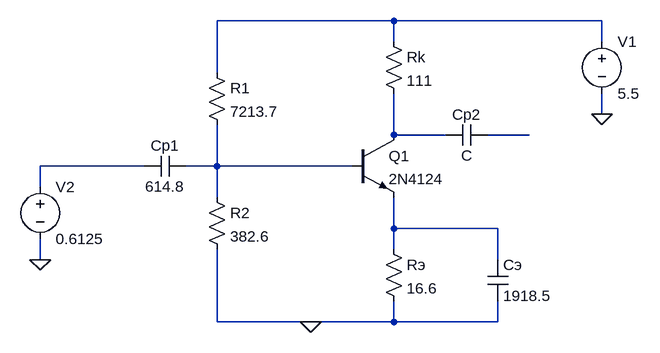
[diagram p0: schematic Draft1.asc]
Draft1.asc, the LTspice schematic file:
Version 4
SHEET 1 944 680
WIRE 560 -64 288 -64
WIRE 880 -64 560 -64
WIRE 560 -32 560 -64
WIRE 880 -32 880 -64
WIRE 288 16 288 -64
WIRE 880 80 880 48
WIRE 560 112 560 48
WIRE 640 112 560 112
WIRE 768 112 704 112
WIRE 176 160 16 160
WIRE 288 160 288 96
WIRE 288 160 240 160
WIRE 496 160 288 160
WIRE 16 192 16 160
WIRE 288 208 288 160
WIRE 560 256 560 208
WIRE 720 256 560 256
WIRE 560 288 560 256
WIRE 16 304 16 272
WIRE 720 304 720 256
WIRE 288 400 288 288
WIRE 432 400 288 400
WIRE 560 400 560 368
WIRE 560 400 432 400
WIRE 720 400 720 368
WIRE 720 400 560 400
FLAG 16 304 0
FLAG 432 400 0
FLAG 880 80 0
SYMBOL voltage 16 176 R0
SYMATTR InstName V2
SYMATTR Value 0.6125
SYMBOL cap 240 144 R90
WINDOW 0 0 32 VBottom 2
WINDOW 3 32 32 VTop 2
SYMATTR InstName Cp1
SYMATTR Value 614.8
SYMBOL res 272 0 R0
SYMATTR InstName R1
SYMATTR Value 7213.7
SYMBOL res 272 192 R0
SYMATTR InstName R2
SYMATTR Value 382.6
SYMBOL res 544 272 R0
SYMATTR InstName Rэ
SYMATTR Value 16.6
SYMBOL res 544 -48 R0
SYMATTR InstName Rk
SYMATTR Value 111
SYMBOL npn 496 112 R0
SYMATTR InstName Q1
SYMATTR Value 2N4124
SYMBOL cap 704 304 R0
SYMATTR InstName Cэ
SYMATTR Value 1918.5
SYMBOL cap 704 96 R90
WINDOW 0 0 32 VBottom 2
WINDOW 3 32 32 VTop 2
SYMATTR InstName Cp2
SYMBOL voltage 880 -48 R0
SYMATTR InstName V1
SYMATTR Value 5.5

The netlist it stands for:
* Draft1.asc
V2 N004 0 0.6125
Cp1 N005 N004 614.8
R1 N001 N005 7213.7
R2 N005 0 382.6
Rэ N006 0 16.6
Rk N001 N002 111
Q1 N002 N005 N006 0 2N4124
Cэ N006 0 1918.5
Cp2 N003 N002 C
V1 N001 0 5.5
.model NPN NPN
.model PNP PNP
.lib standard.bjt
.backanno
.end